# Altium project ResistorDecadeBox.PrjPcb
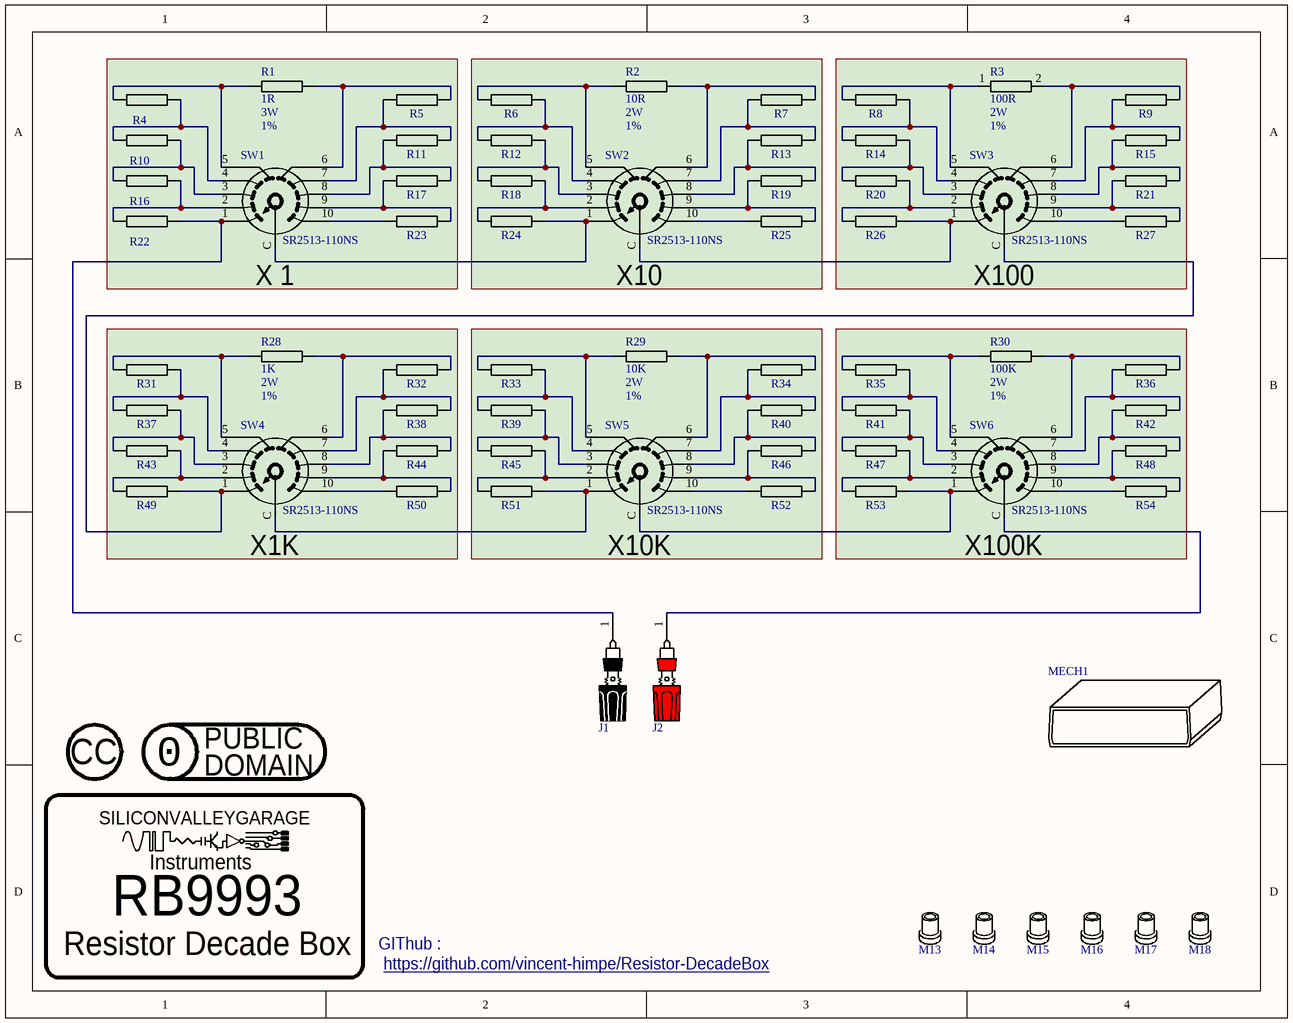
[diagram p0: ResistorDecadeBox.SchDoc]
SCHdrafter: Vincent Himpe
1 sheet, 72 parts. Net scope: global (net labels, ports and power ports of the same name join across sheets).
Board files: ResistorDecadeBox.PcbDoc, ResistorDecadeBox-FRONT.PcbDoc

## Sheet ResistorDecadeBox.SchDoc
size A; SheetNumber: 1; SheetTotal: 1

### Parts
J1  BANANA BLACK, CHASSIS  (value not drawn)
J2  BANANA RED, CHASSIS  (value not drawn)
LOGO1  LOGO-LICENSE-CC0-PUBLIC  [LOGO-LICENSE-CC0-PUBLIC]  (value not drawn)  (no BOM)
LOGO2  LOGO-LICENSE-CC  [LOGO-LICENSE-CC]  (value not drawn)  (no BOM)
LOGO?  LOGO-SILICONVALLEYGARAGE-SMALL  [SILICONVALLEYGARAGE]  (value not drawn)  (graphical)
M13  STANDOFF  (value not drawn)  (mechanical)
M14  STANDOFF  (value not drawn)  (mechanical)
M15  STANDOFF  (value not drawn)  (mechanical)
M16  STANDOFF  (value not drawn)  (mechanical)
M17  STANDOFF  (value not drawn)  (mechanical)
M18  STANDOFF  (value not drawn)  (mechanical)
MECH1  HAMMOND HM1100-ND  (value not drawn)  (mechanical)
R1  value 1R  Power: 3W  Tolerance: 1%  [RES-YAGEO-FMP300-VERT]  (hidden comment: RESTH-VERT-1R-1%-3W)
R2  value 10R  Power: 2W  Tolerance: 1%  [RES-YAGEO-FMP300-VERT]  (hidden comment: RESTH-VERT-10R-1%-2W)
R3  value 100R  Power: 2W  Tolerance: 1%  [RES-YAGEO-FMP300-VERT]  (hidden comment: RESTH-VERT-100R-1%-2W)
R4  RESTH-VERT-1R-1%-3W  [RES-YAGEO-FMP300-VERT]  (value not drawn)
R5  RESTH-VERT-1R-1%-3W  [RES-YAGEO-FMP300-VERT]  (value not drawn)
R6  RESTH-VERT-10R-1%-2W  [RES-YAGEO-FMP300-VERT]  (value not drawn)
R7  RESTH-VERT-10R-1%-2W  [RES-YAGEO-FMP300-VERT]  (value not drawn)
R8  RESTH-VERT-100R-1%-2W  [RES-YAGEO-FMP300-VERT]  (value not drawn)
R9  RESTH-VERT-100R-1%-2W  [RES-YAGEO-FMP300-VERT]  (value not drawn)
R10  RESTH-VERT-1R-1%-3W  [RES-YAGEO-FMP300-VERT]  (value not drawn)
R11  RESTH-VERT-1R-1%-3W  [RES-YAGEO-FMP300-VERT]  (value not drawn)
R12  RESTH-VERT-10R-1%-2W  [RES-YAGEO-FMP300-VERT]  (value not drawn)
R13  RESTH-VERT-10R-1%-2W  [RES-YAGEO-FMP300-VERT]  (value not drawn)
R14  RESTH-VERT-100R-1%-2W  [RES-YAGEO-FMP300-VERT]  (value not drawn)
R15  RESTH-VERT-100R-1%-2W  [RES-YAGEO-FMP300-VERT]  (value not drawn)
R16  RESTH-VERT-1R-1%-3W  [RES-YAGEO-FMP300-VERT]  (value not drawn)
R17  RESTH-VERT-1R-1%-3W  [RES-YAGEO-FMP300-VERT]  (value not drawn)
R18  RESTH-VERT-10R-1%-2W  [RES-YAGEO-FMP300-VERT]  (value not drawn)
R19  RESTH-VERT-10R-1%-2W  [RES-YAGEO-FMP300-VERT]  (value not drawn)
R20  RESTH-VERT-100R-1%-2W  [RES-YAGEO-FMP300-VERT]  (value not drawn)
R21  RESTH-VERT-100R-1%-2W  [RES-YAGEO-FMP300-VERT]  (value not drawn)
R22  RESTH-VERT-1R-1%-3W  [RES-YAGEO-FMP300-VERT]  (value not drawn)
R23  RESTH-VERT-1R-1%-3W  [RES-YAGEO-FMP300-VERT]  (value not drawn)
R24  RESTH-VERT-10R-1%-2W  [RES-YAGEO-FMP300-VERT]  (value not drawn)
R25  RESTH-VERT-10R-1%-2W  [RES-YAGEO-FMP300-VERT]  (value not drawn)
R26  RESTH-VERT-100R-1%-2W  [RES-YAGEO-FMP300-VERT]  (value not drawn)
R27  RESTH-VERT-100R-1%-2W  [RES-YAGEO-FMP300-VERT]  (value not drawn)
R28  value 1K  Power: 2W  Tolerance: 1%  [RES-YAGEO-FMP300-VERT]  (hidden comment: RESTH-VERT-1K-1%-2W)
R29  value 10K  Power: 2W  Tolerance: 1%  [RES-YAGEO-FMP300-VERT]  (hidden comment: RESTH-VERT-10K-1%-2W)
R30  value 100K  Power: 2W  Tolerance: 1%  [RES-YAGEO-FMP300-VERT]  (hidden comment: RESTH-VERT-100K-1%-2W)
R31  RESTH-VERT-1K-1%-2W  [RES-YAGEO-FMP300-VERT]  (value not drawn)
R32  RESTH-VERT-1K-1%-2W  [RES-YAGEO-FMP300-VERT]  (value not drawn)
R33  RESTH-VERT-10K-1%-2W  [RES-YAGEO-FMP300-VERT]  (value not drawn)
R34  RESTH-VERT-10K-1%-2W  [RES-YAGEO-FMP300-VERT]  (value not drawn)
R35  RESTH-VERT-100K-1%-2W  [RES-YAGEO-FMP300-VERT]  (value not drawn)
R36  RESTH-VERT-100K-1%-2W  [RES-YAGEO-FMP300-VERT]  (value not drawn)
R37  RESTH-VERT-1K-1%-2W  [RES-YAGEO-FMP300-VERT]  (value not drawn)
R38  RESTH-VERT-1K-1%-2W  [RES-YAGEO-FMP300-VERT]  (value not drawn)
R39  RESTH-VERT-10K-1%-2W  [RES-YAGEO-FMP300-VERT]  (value not drawn)
R40  RESTH-VERT-10K-1%-2W  [RES-YAGEO-FMP300-VERT]  (value not drawn)
R41  RESTH-VERT-100K-1%-2W  [RES-YAGEO-FMP300-VERT]  (value not drawn)
R42  RESTH-VERT-100K-1%-2W  [RES-YAGEO-FMP300-VERT]  (value not drawn)
R43  RESTH-VERT-1K-1%-2W  [RES-YAGEO-FMP300-VERT]  (value not drawn)
R44  RESTH-VERT-1K-1%-2W  [RES-YAGEO-FMP300-VERT]  (value not drawn)
R45  RESTH-VERT-10K-1%-2W  [RES-YAGEO-FMP300-VERT]  (value not drawn)
R46  RESTH-VERT-10K-1%-2W  [RES-YAGEO-FMP300-VERT]  (value not drawn)
R47  RESTH-VERT-100K-1%-2W  [RES-YAGEO-FMP300-VERT]  (value not drawn)
R48  RESTH-VERT-100K-1%-2W  [RES-YAGEO-FMP300-VERT]  (value not drawn)
R49  RESTH-VERT-1K-1%-2W  [RES-YAGEO-FMP300-VERT]  (value not drawn)
R50  RESTH-VERT-1K-1%-2W  [RES-YAGEO-FMP300-VERT]  (value not drawn)
R51  RESTH-VERT-10K-1%-2W  [RES-YAGEO-FMP300-VERT]  (value not drawn)
R52  RESTH-VERT-10K-1%-2W  [RES-YAGEO-FMP300-VERT]  (value not drawn)
R53  RESTH-VERT-100K-1%-2W  [RES-YAGEO-FMP300-VERT]  (value not drawn)
R54  RESTH-VERT-100K-1%-2W  [RES-YAGEO-FMP300-VERT]  (value not drawn)
SW1  SR2513-110NS  [SWITCH-ALPHA-SR2513F-0110]
SW2  SR2513-110NS  [SWITCH-ALPHA-SR2513F-0110]
SW3  SR2513-110NS  [SWITCH-ALPHA-SR2513F-0110]
SW4  SR2513-110NS  [SWITCH-ALPHA-SR2513F-0110]
SW5  SR2513-110NS  [SWITCH-ALPHA-SR2513F-0110]
SW6  SR2513-110NS  [SWITCH-ALPHA-SR2513F-0110]

### Blocks framed on the sheet
X 1: R1 R4 R5 R10 R11 R16 R17 R22 R23 SW1
X10: R2 R6 R7 R12 R13 R18 R19 R24 R25 SW2
X100: R3 R8 R9 R14 R15 R20 R21 R26 R27 SW3
X1K: R28 R31 R32 R37 R38 R43 R44 R49 R50 SW4
X10K: R29 R33 R34 R39 R40 R45 R46 R51 R52 SW5
X100K: R30 R35 R36 R41 R42 R47 R48 R53 R54 SW6
RB9993: LOGO?

### Nets
NetJ1_1: J1.1 R22.2 SW1.1
NetJ2_1: J2.1 SW6.C
NetR1_1: R1.1 R5.2 SW1.6
NetR1_2: R1.2 R4.1 SW1.5
NetR2_1: R2.1 R6.1 SW2.5
NetR2_2: R2.2 R7.2 SW2.6
NetR3_1: R3.1 R8.1 SW3.5
NetR3_2: R3.2 R9.2 SW3.6
NetR4_2: R4.2 R10.1 SW1.4
NetR5_1: R5.1 R11.2 SW1.7
NetR6_2: R6.2 R12.1 SW2.4
NetR7_1: R7.1 R13.2 SW2.7
NetR8_2: R8.2 R14.1 SW3.4
NetR9_1: R9.1 R15.2 SW3.7
NetR10_2: R10.2 R16.1 SW1.3
NetR11_1: R11.1 R17.2 SW1.8
NetR12_2: R12.2 R18.1 SW2.3
NetR13_1: R13.1 R19.2 SW2.8
NetR14_2: R14.2 R20.1 SW3.3
NetR15_1: R15.1 R21.2 SW3.8
NetR16_2: R16.2 R22.1 SW1.2
NetR17_1: R17.1 R23.2 SW1.9
NetR18_2: R18.2 R24.1 SW2.2
NetR19_1: R19.1 R25.2 SW2.9
NetR20_2: R20.2 R26.1 SW3.2
NetR21_1: R21.1 R27.2 SW3.9
NetR23_1: R23.1 SW1.10
NetR24_2: R24.2 SW1.C SW2.1
NetR25_1: R25.1 SW2.10
NetR26_2: R26.2 SW2.C SW3.1
NetR27_1: R27.1 SW3.10
NetR28_1: R28.1 R31.1 SW4.5
NetR28_2: R28.2 R32.2 SW4.6
NetR29_1: R29.1 R33.1 SW5.5
NetR29_2: R29.2 R34.2 SW5.6
NetR30_1: R30.1 R35.1 SW6.5
NetR30_2: R30.2 R36.2 SW6.6
NetR31_2: R31.2 R37.1 SW4.4
NetR32_1: R32.1 R38.2 SW4.7
NetR33_2: R33.2 R39.1 SW5.4
NetR34_1: R34.1 R40.2 SW5.7
NetR35_2: R35.2 R41.1 SW6.4
NetR36_1: R36.1 R42.2 SW6.7
NetR37_2: R37.2 R43.1 SW4.3
NetR38_1: R38.1 R44.2 SW4.8
NetR39_2: R39.2 R45.1 SW5.3
NetR40_1: R40.1 R46.2 SW5.8
NetR41_2: R41.2 R47.1 SW6.3
NetR42_1: R42.1 R48.2 SW6.8
NetR43_2: R43.2 R49.1 SW4.2
NetR44_1: R44.1 R50.2 SW4.9
NetR45_2: R45.2 R51.1 SW5.2
NetR46_1: R46.1 R52.2 SW5.9
NetR47_2: R47.2 R53.1 SW6.2
NetR48_1: R48.1 R54.2 SW6.9
NetR49_2: R49.2 SW3.C SW4.1
NetR50_1: R50.1 SW4.10
NetR51_2: R51.2 SW4.C SW5.1
NetR52_1: R52.1 SW5.10
NetR53_2: R53.2 SW5.C SW6.1
NetR54_1: R54.1 SW6.10

### Notes on the sheet
- (near LOGO?) Instruments
- Resistor Decade Box
- https://github.com/vincent-himpe/Resistor-DecadeBox
- GIThub :
- (in symbol LOGO-LICENSE-CC) CC
- (in symbol LOGO-LICENSE-CC0-PUBLIC) PUBLIC; 0; DOMAIN
- (in symbol LOGO-SILICONVALLEYGARAGE-SMALL) SILICONVALLEYGARAGE

### Library data of the parts
J1 = CONN-CLIFF-CL1505: CONNECTOR,BANANA BINDING POST,BLACK,CLIFF CL15XX; Manufacturer 1: CLIFF ELECTRONICS; Manufacturer Part Number 1: CL1505; DIGIKEY: 4654-CL1505-ND
J2 = CONN-CLIFF-CL1506: CONNECTOR,BANANA BINDING POST,RED,CLIFF CL15XX; Manufacturer 1: CLIFF ELECTRONICS; Manufacturer Part Number 1: CL1506; DIGIKEY: 4654-CL1506-ND
LOGO? = LOGO-SILICONVALLEYGARAGE-SMALL: LOGO,SILICONVALLEYGARAGE,SMALL
M13-M18 = MECH-STANDOFF-M3-SMD-WURTH-9775041360R: MECH,STANDOFF,M3,5.11mm,SMD,WURTH; DIGIKEY: 732-10919-1-ND; Manufacturer 1: WURTH; Manufacturer Part Number 1: 9775041360R
MECH1 = MECH-HAMMOND-1553: ENCLOSURE,ABS,GRAY,HAMMOND, RM2095M; DIGIKEY: HM1100-ND; Manufacturer 1: HAMMOND; Manufacturer Part Number 1: RM2095M
R1 R4 R5 R10 R11 R16 R17 R22 R23 = RESTH-VERT-1R-1%-3W: RESISTOR,TH,VERT,1R,1%,3W; Manufacturer 1: YAGEO; Manufacturer Part Number 1: FMP300FRF73-1R; Location: *; Parameter 4: *; DIGIKEY: 13-FMP300FRF73-1RCT-ND; MOUSER: 603-FMP300FRF73-1R
  R4 R5 R10 R11 R16 R17 R22 R23: Power: 3W; Tolerance: 1%; Value: 1R
R2 R6 R7 R12 R13 R18 R19 R24 R25 = RESTH-VERT-10R-1%-2W: RESISTOR,TH,VERT,10R,1%,2W; Manufacturer 1: YAGEO; Manufacturer Part Number 1: MFR200FRF52-10R; Location: *; Parameter 4: *; DIGIKEY: 13-MFR200FRF52-10RCT-ND; MOUSER: 603-MFR200FRF52-10R
  R6 R7 R12 R13 R18 R19 R24 R25: Power: 2W; Tolerance: 1%; Value: 10R
R3 R8 R9 R14 R15 R20 R21 R26 R27 = RESTH-VERT-100R-1%-2W: RESISTOR,TH,VERT,100R,1%,2W; Manufacturer 1: YAGEO; Manufacturer Part Number 1: FMP200FRF52-100R; Location: *; Parameter 4: *; DIGIKEY: 100YCT-ND; MOUSER: 603-FMP200FRF52-100R
  R8 R9 R14 R15 R20 R21 R26 R27: Power: 2W; Tolerance: 1%; Value: 100R
R28 R31 R32 R37 R38 R43 R44 R49 R50 = RESTH-VERT-1K-1%-2W: RESISTOR,TH,VERT,1K,1%,2W; Manufacturer 1: YAGEO; Manufacturer Part Number 1: MFR200FRF52-1K; Location: *; Parameter 4: *; DIGIKEY: 13-MFR200FRF52-1KCT-ND; MOUSER: 603-MFR200FRF52-1K
  R31 R32 R37 R38 R43 R44 R49 R50: Power: 2W; Tolerance: 1%; Value: 1K
R29 R33 R34 R39 R40 R45 R46 R51 R52 = RESTH-VERT-10K-1%-2W: RESISTOR,TH,VERT,10K,1%,2W; Manufacturer 1: YAGEO; Manufacturer Part Number 1: FMP200FRF52-10K; Location: *; Parameter 4: *; DIGIKEY: 10KYCT-ND; MOUSER: 603-FMP200FRF52-10K
  R33 R34 R39 R40 R45 R46 R51 R52: Power: 2W; Tolerance: 1%; Value: 10K
R30 R35 R36 R41 R42 R47 R48 R53 R54 = RESTH-VERT-100K-1%-2W: RESISTOR,TH,VERT,100K,1%,2W; Manufacturer 1: YAGEO; Manufacturer Part Number 1: MFR200FRF52-100K; Location: *; Parameter 4: *; DIGIKEY: 13-MFR200FRF52-100KCT-ND; MOUSER: 603-MFR200FRF52-100K
  R35 R36 R41 R42 R47 R48 R53 R54: Power: 2W; Tolerance: 1%; Value: 100K
SW1-SW6 = SWITCH-ROTARY-1X10-ALPHA-SR2513-110NS: SWITCH,SP10T,ROTARY,TH,REAR MOUNT,ALPHA SR2512-XXX; Manufacturer 1: TAIWAN ALPHA; DIGIKEY: 5942-SR2513-110NS-ND; Manufacturer Part Number 1: SR2513-110NS